# EAGLE design LED-Lampe MCU (EAGLE 6.5.0)
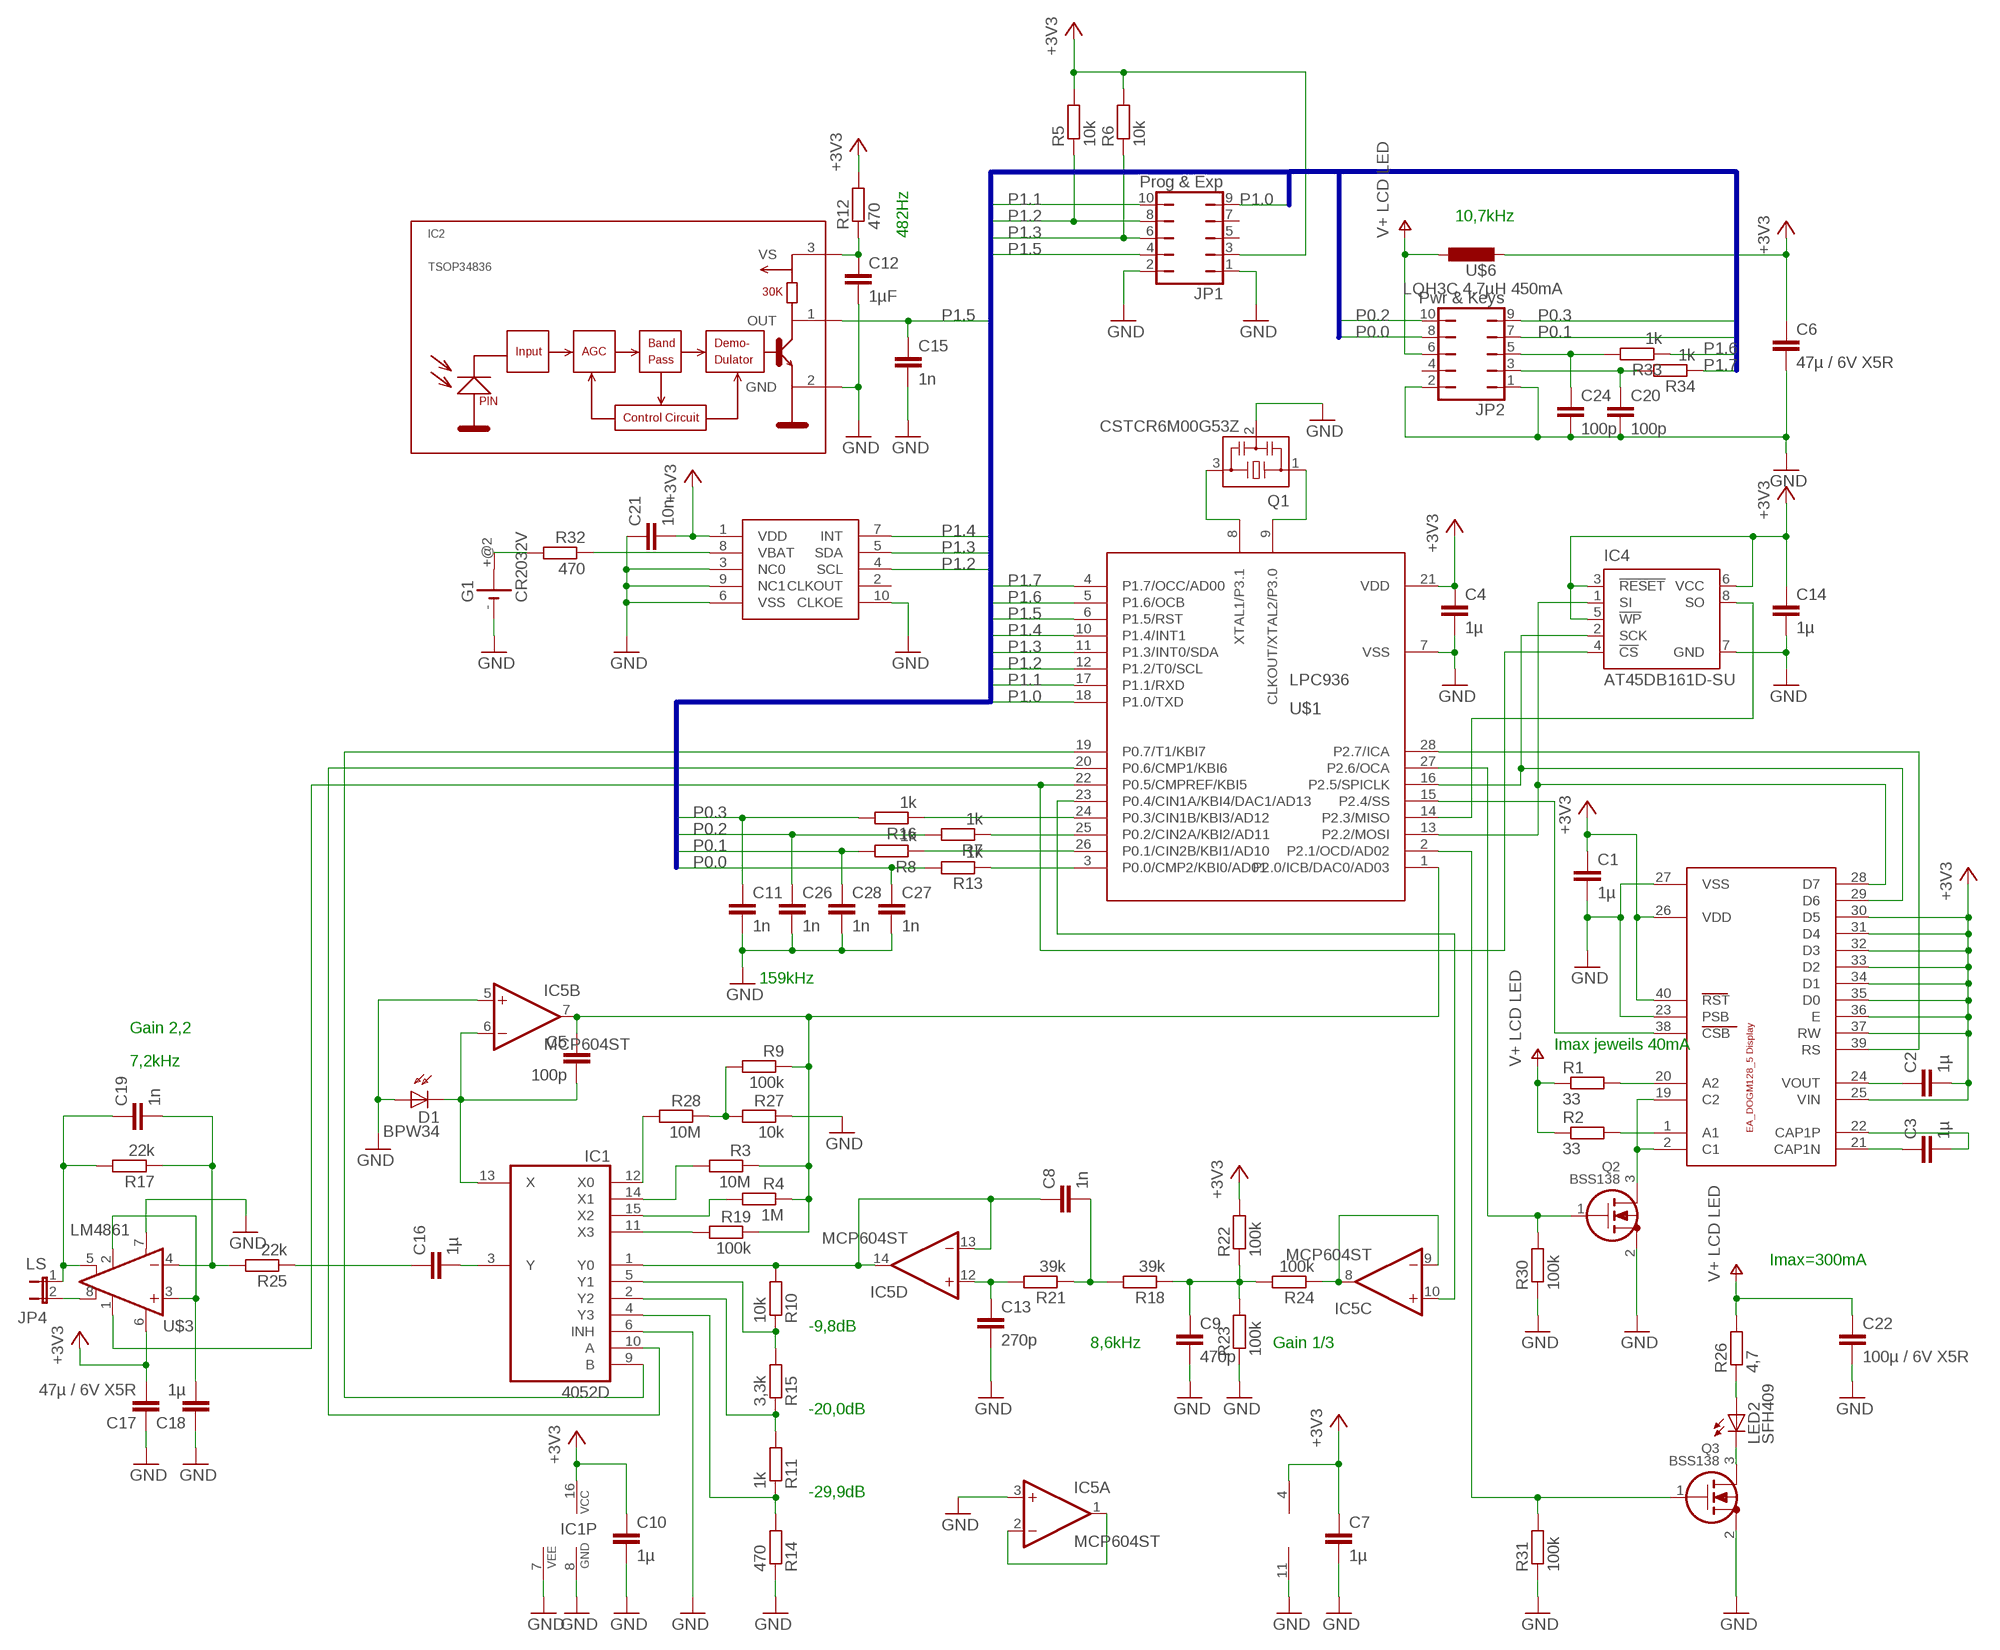
[diagram p0: schematic, sheet 1]

## Parts
C1  1µ  C-EUC0805  [C0805]
C2  1µ  C-EUC0805  [C0805]
C3  1µ  C-EUC0805  [C0805]
C4  1µ  C-EUC0805  [C0805]
C5  100p  C-EUC0603  [C0603]
C6  47µ / 6V X5R  C-EUC1206  [C1206]
C7  1µ  C-EUC0805  [C0805]
C8  1n  C-EUC0805  [C0805]
C9  470p  C-EUC0805  [C0805]
C10  1µ  C-EUC0805  [C0805]
C11  1n  C-EUC0603  [C0603]
C12  1µF  C-EUC0805  [C0805]
C13  270p  C-EUC0805  [C0805]
C14  1µ  C-EUC0805  [C0805]
C15  1n  C-EUC0603  [C0603]
C16  1µ  C-EUC1206  [C1206]
C17  47µ / 6V X5R  C-EUC1206  [C1206]
C18  1µ  C-EUC1206  [C1206]
C19  1n  C-EUC0805  [C0805]
C20  100p  C-EUC0603  [C0603]
C21  10n  C-EUC0805  [C0805]
C22  100µ / 6V X5R  C-EUC1206  [C1206]
C24  100p  C-EUC0603  [C0603]
C26  1n  C-EUC0603  [C0603]
C27  1n  C-EUC0603  [C0603]
C28  1n  C-EUC0603  [C0603]
D1  BPW34  BPW32  [BPW32]
G1  CR2032V  [CR2032V]
IC1  4052D  [SO16]
IC2  TSOP34836  [TSOP348]
IC4  AT45DB161D-SU  [8S2]
IC5  MCP604ST  [TSSOP14]
JP1  Prog & Exp  JP5Q  [JP5Q]
JP2  Pwr & Keys  JP5Q  [JP5Q]
JP4  LS  JP1E  [JP1]
LED2  SFH409  LED3MM  [LED3MM]
Q1  CSTCR6M00G53Z  [CSTCR6M]
Q2  BSS138  [SOT23]
Q3  BSS138  [SOT23]
R1  33  R-EU_R1206  [R1206]
R2  33  R-EU_R1206  [R1206]
R3  10M  R-EU_R0805  [R0805]
R4  1M  R-EU_R0805  [R0805]
R5  10k  R-EU_R0805  [R0805]
R6  10k  R-EU_R0805  [R0805]
R7  1k  R-EU_R0805  [R0805]
R8  1k  R-EU_R0805  [R0805]
R9  100k  R-EU_R0805  [R0805]
R10  10k  R-EU_R0805  [R0805]
R11  1k  R-EU_R0805  [R0805]
R12  470  R-EU_R0805  [R0805]
R13  1k  R-EU_R0805  [R0805]
R14  470  R-EU_R0805  [R0805]
R15  3,3k  R-EU_R0805  [R0805]
R16  1k  R-EU_R0805  [R0805]
R17  22k  R-EU_R0805  [R0805]
R18  39k  R-EU_R0805  [R0805]
R19  100k  R-EU_R0805  [R0805]
R21  39k  R-EU_R0805  [R0805]
R22  100k  R-EU_R0805  [R0805]
R23  100k  R-EU_R0805  [R0805]
R24  100k  R-EU_R0805  [R0805]
R25  22k  R-EU_R0805  [R0805]
R26  4,7  R-EU_R1206  [R1206]
R27  10k  R-EU_R0805  [R0805]
R28  10M  R-EU_R0805  [R0805]
R30  100k  R-EU_R0805  [R0805]
R31  100k  R-EU_R0805  [R0805]
R32  470  R-EU_R0805  [R0805]
R33  1k  R-EU_R0805  [R0805]
R34  1k  R-EU_R0805  [R0805]
U$1  LPC936  [TSSOP28]
U$2  EA_DOGM162  [E_DOG-M162]
U$3  LM4861  [SO08]
U$4  RV3029-C2  [MC_RTC]
U$6  LQH3C 4,7µH 450mA  LQH3C  [L1210]

## Nets
+3V3: C1.1 C2.2 C4.1 C6.1 C7.1 C10.1 C14.1 C17.2 C21.2 IC1.16(VCC) IC4.3(!RESET) IC4.5(!WP) IC4.6(VCC) IC5.4(P:V+) JP1.3 R5.2 R6.2 R12.2 R22.2 U$1.21(VDD) U$2.25(VIN) U$2.26(VDD) U$2.30(D5) U$2.31(D4) U$2.32(D3) U$2.33(D2) U$2.34(D1) U$2.35(D0) U$2.36(E) U$2.37(RW) U$2.40(RST) U$3.6(VDD) U$4.1(VDD) U$6.2
GND: C1.2 C4.2 C6.2 C7.2 C9.2 C10.2 C11.2 C12.2 C13.2 C14.2 C15.2 C17.1 C18.1 C20.2 C21.1 C22.2 C24.2 C26.2 C27.2 C28.2 D1.A G1.- IC1.6(INH) IC1.7(VEE) IC1.8(GND) IC2.2(GND) IC4.7(GND) IC5.3(A:+IN) IC5.5(B:+IN) IC5.11(P:V-) JP1.1 JP1.2 JP2.1 JP2.2 Q1.2 Q2.2(S) Q3.2(S) R14.1 R23.1 R27.1 R30.1 R31.1 U$1.7(VSS) U$2.23(PSB) U$2.27(VSS) U$3.7(GND) U$4.3(NC0) U$4.6(VSS) U$4.9(NC1) U$4.10(CLKOE)
N$1: C2.1 U$2.24(VOUT)
N$2: IC1.9(B) U$1.19(P0.7/T1/KBI7)
N$3: C3.2 U$2.22(CAP1P)
N$4: C3.1 U$2.21(CAP1N)
N$5: U$1.15(P2.4/SS) U$2.38(CSB)
N$6: C12.1 IC2.3(VS) R12.1
N$7: R1.2 U$2.20(A2)
N$8: R2.2 U$2.1(A1)
N$9: IC4.2(SCK) U$1.16(P2.5/SPICLK) U$2.29(D6)
N$10: IC4.1(SI) U$1.13(P2.2/MOSI) U$2.28(D7)
N$11: Q2.1(G) R30.2 U$1.27(P2.6/OCA)
N$12: IC1.10(A) U$1.20(P0.6/CMP1/KBI6)
N$13: U$1.28(P2.7/ICA) U$2.39(RS)
N$14: Q1.3 U$1.8(XTAL1/P3.1)
N$15: Q1.1 U$1.9(CLKOUT/XTAL2/P3.0)
N$16: Q2.3(D) U$2.2(C1) U$2.19(C2)
N$17: R8.1 U$1.26(P0.1/CIN2B/KBI1/AD10)
N$18: JP4.2 U$3.8(VO2)
N$19: R16.1 U$1.24(P0.3/CIN1B/KBI3/AD12)
N$20: R13.1 U$1.3(P0.0/CMP2/KBI0/AD01)
N$21: C18.2 U$3.2(BYPASS) U$3.3(+IN)
N$22: R7.1 U$1.25(P0.2/CIN2A/KBI2/AD11)
N$23: IC4.8(SO) U$1.14(P2.3/MISO)
N$25: IC1.4(Y3) R11.1 R14.2
N$26: IC1.2(Y2) R11.2 R15.1
N$27: IC1.5(Y1) R10.1 R15.2
N$28: C8.1 IC1.1(Y0) IC5.13(D:-IN) IC5.14(D:OUT) R10.2
N$29: C13.1 IC5.12(D:+IN) R21.2
N$30: C8.2 R18.2 R21.1
N$31: LED2.A R26.1
N$32: IC5.10(C:+IN) U$1.23(P0.4/CIN1A/KBI4/DAC1/AD13)
N$33: C5.2 D1.K(C) IC1.13(X) IC5.6(B:-IN)
N$34: C5.1 IC5.7(B:OUT) R3.1 R4.1 R9.1 R19.1 U$1.1(P2.0/ICB/DAC0/AD03)
N$35: IC1.11(X3) R19.2
N$36: C9.1 R18.1 R22.1 R23.2 R24.2
N$37: Q3.1(G) R31.2 U$1.2(P2.1/OCD/AD02)
N$38: IC1.15(X2) R4.2
N$39: IC1.14(X1) R3.2
N$40: IC1.12(X0) R28.2
N$41: C19.2 R17.1 R25.2 U$3.4(-IN)
N$42: C16.1 R25.1
N$44: C16.2 IC1.3(Y)
N$45: C19.1 JP4.1 R17.2 U$3.5(VO1)
N$46: LED2.K(C) Q3.3(D)
N$47: IC4.4(!CS) U$1.22(P0.5/CMPREF/KBI5) U$3.1(SHUTDOWN)
N$49: R32.1 U$4.8(VBAT)
N$50: R9.2 R27.2 R28.1
N$51: IC5.8(C:OUT) IC5.9(C:-IN) R24.1
N$52: G1.+@2(+) R32.2
N$53: IC5.1(A:OUT) IC5.2(A:-IN)
N$55: C24.1 JP2.5 R33.2
N$56: C20.1 JP2.3 R34.2
P0.0: C27.1 JP2.8 R13.2
P0.1: C28.1 JP2.7 R8.2
P0.2: C26.1 JP2.10 R7.2
P0.3: C11.1 JP2.9 R16.2
P1.0: JP1.9 U$1.18(P1.0/TXD)
P1.1: JP1.10 U$1.17(P1.1/RXD)
P1.2: JP1.8 R5.1 U$1.12(P1.2/T0/SCL) U$4.4(SCL)
P1.3: JP1.6 R6.1 U$1.11(P1.3/INT0/SDA) U$4.5(SDA)
P1.4: U$1.10(P1.4/INT1) U$4.7(INT)
P1.5: C15.1 IC2.1(OUT) JP1.4 U$1.6(P1.5/RST)
P1.6: R33.1 U$1.5(P1.6/OCB)
P1.7: R34.1 U$1.4(P1.7/OCC/AD00)
V+: C22.1 JP2.6 R1.1 R2.1 R26.2 U$6.1 ; supply symbol labelled V+ LCD LED
Unconnected: G1.+ JP1.5 JP1.7 JP2.4 U$4.2(CLKOUT)

## Buses
P1.[0..7],P0.[0..7]

## Notes on the sheet
- 10,7kHz
- 482Hz
- 159kHz
- Gain 2,2
- Imax jeweils 40mA
- 7,2kHz
- Imax=300mA
- -9,8dB
- 8,6kHz | Gain 1/3
- -20,0dB
- -29,9dB

## Library data of the parts
C1-C5 C7-C21 C24 C26-C28 = rcl:C-EU: CAPACITOR, European symbol
C6 C22 = resistor:C-EU: CAPACITOR, European symbol
D1 = opto-trans-siemens:BPW32: PHOTO DIODE; OC_FARNELL: unknown; OC_NEWARK: unknown
G1 = battery:CR2032V: LI BATTERY Varta
IC1 = 40xx:4052: Dual 4-channel ANALOG MULTIPLEXER
IC2 = vishay-1:TSOP348*: IR Receiver Modules for Remote Control Systems http://www.vishay.com/ir-receiver-modules/
IC4 = atmel:AT45DB161D: 16-megabit 2.5V or 2.7V DataFlash Source: http://www.atmel.com/dyn/resources/prod_documents/doc3500.pdf; MF: ATMEL; MPN: AT45DB161D-SU; OC_FARNELL: 1455040
IC5 = linear:MCP604: Quad Op Amp 2.7V to 6.0V Single Supply CMOS Source: http://ww1.microchip.com/downloads/en/DeviceDoc/21314g.pdf
JP1 JP2 = jumper:JP5Q: JUMPER
JP4 = jumper:JP1E: JUMPER
LED2 = led:LED: LED OSRAM: - CHIPLED LG R971, LG N971, LY N971, LG Q971, LY Q971, LO R971, LY R971 LH N974, LH R974 LS Q976, LO Q976, LY Q976 LO Q996 - Hyper CHIPLED LW Q18S LB Q993, LB Q99A, LB R99A - SideLED LS A670, LO A670, LY A670, LG A670, LP A670 LB A673, LV A673, LT A673, LW A673 LH A674 LY A675 LS A676, LA A676, LO A676, LY A676, LW A676 LS A679, LY A679, LG A679 - Hyper Micro SIDELED® LS Y876, LA Y876, LO Y876, LY Y876 LT Y87S - SmartLED LW L88C, LW L88S LB L89C, LB L89S, LG L890 LS L89K, LO L89K, LY L89K LS L896, LA L896, LO L896, LY L896 - TOPLED LS T670, LO T670, LY T670, LG T670, LP T670 LSG T670, LSP T670, LSY T670, LOP T670, LYG T670 LG T671, LOG T671, LSG T671 LB T673, LV T673, LT T673, LW T673 LH T674 LS T676, LA T676, LO T676, LY T676, LB T676, LH T676, LSB T676, LW T676 LB T67C, LV T67C, LT T67C, LS T67K, LO T67K, LY T67K, LW E67C LS E67B, LA E67B, LO E67B, LY E67B, LB E67C, LV E67C, LT E67C LW T67C LS T679, LY T679, LG T679 LS T770, LO T770, LY T770, LG T770, LP T770 LB T773, LV T773, LT T773, LW T773 LH T774 LS E675, LA E675, LY E675, LS T675 LS T776, LA T776, LO T776, LY T776, LB T776 LHGB T686 LT T68C, LB T68C - Hyper Mini TOPLED® LB M676 - Mini TOPLED Santana® LG M470 LS M47K, LO M47K, LY M47K Source: http://www.osram.convergy.de LUXEON: - LUMILED® LXK2-PW12-R00, LXK2-PW12-S00, LXK2-PW14-U00, LXK2-PW14-V00 LXK2-PM12-R00, LXK2-PM12-S00, LXK2-PM14-U00 LXK2-PE12-Q00, LXK2-PE12-R00, LXK2-PE12-S00, LXK2-PE14-T00, LXK2-PE14-U00 LXK2-PB12-K00, LXK2-PB12-L00, LXK2-PB12-M00, LXK2-PB14-N00, LXK2-PB14-P00, LXK2-PB14-Q00 LXK2-PR12-L00, LXK2-PR12-M00, LXK2-PR14-Q00, LXK2-PR14-R00 LXK2-PD12-Q00, LXK2-PD12-R00, LXK2-PD12-S00 LXK2-PH12-R00, LXK2-PH12-S00 LXK2-PL12-P00, LXK2-PL12-Q00, LXK2-PL12-R00 Source: www.luxeon.com KINGBRIGHT: KA-3528ASYC Source: www.kingbright.com
Q1 = murata-filter:CSTCR: Resonator Source: murata.co.jp; MPN: CSTCR6M00G53-R0; OC_FARNELL: 1170434; OC_NEWARK: 25M8759
Q2 Q3 = transistors:BSS138: BSS138: N-channel enhancement MOSFET (ON Semiconductor) 50V Uds, 200mA Id, 225mW Ptot, 3.5Ω Rdson
R1 R2 R5-R8 R12 R13 R16 R17 R25 R26 R30 R31 R33 R34 = rcl:R-EU_: RESISTOR, European symbol
R3 R4 R9-R11 R14 R15 R18 R19 R21-R24 R27 R28 R32 = resistor:R-EU_: RESISTOR, European symbol
U$1 = nxp:LPC936
U$2 = display_ea_dog:EA_DOGM162
U$3 = LM4861:LM4861
U$4 = MicroCrystal:RV3029-C2
U$6 = mcl:LQH3C: muRata Chip Coil LQH3C

## Board
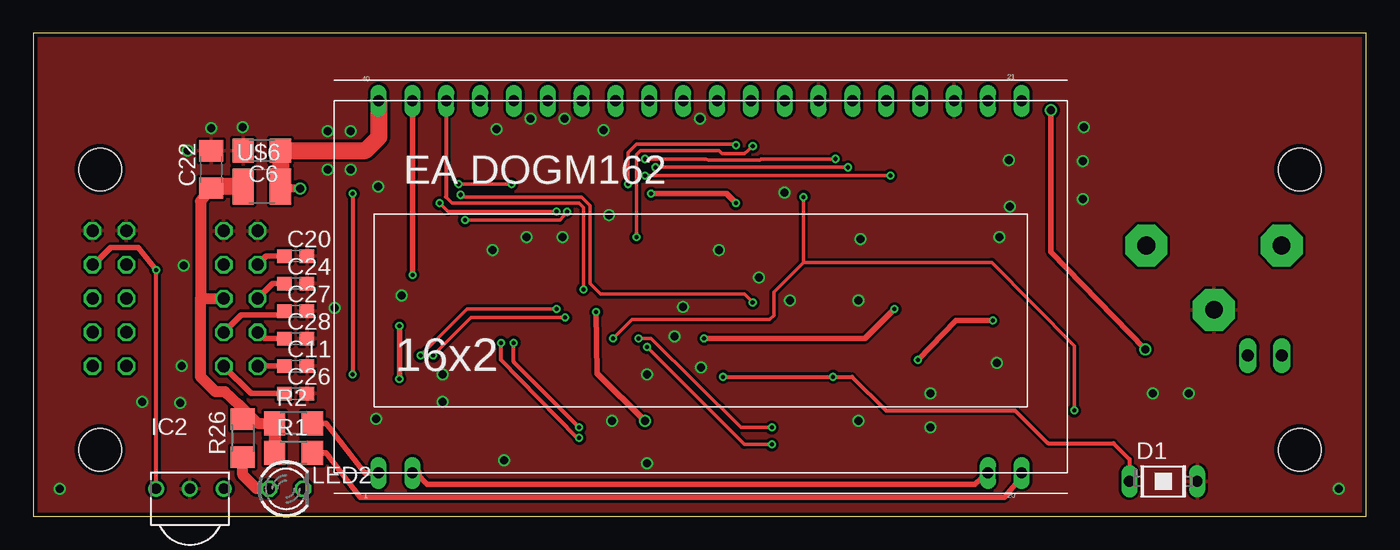
[diagram p1: board, top side]
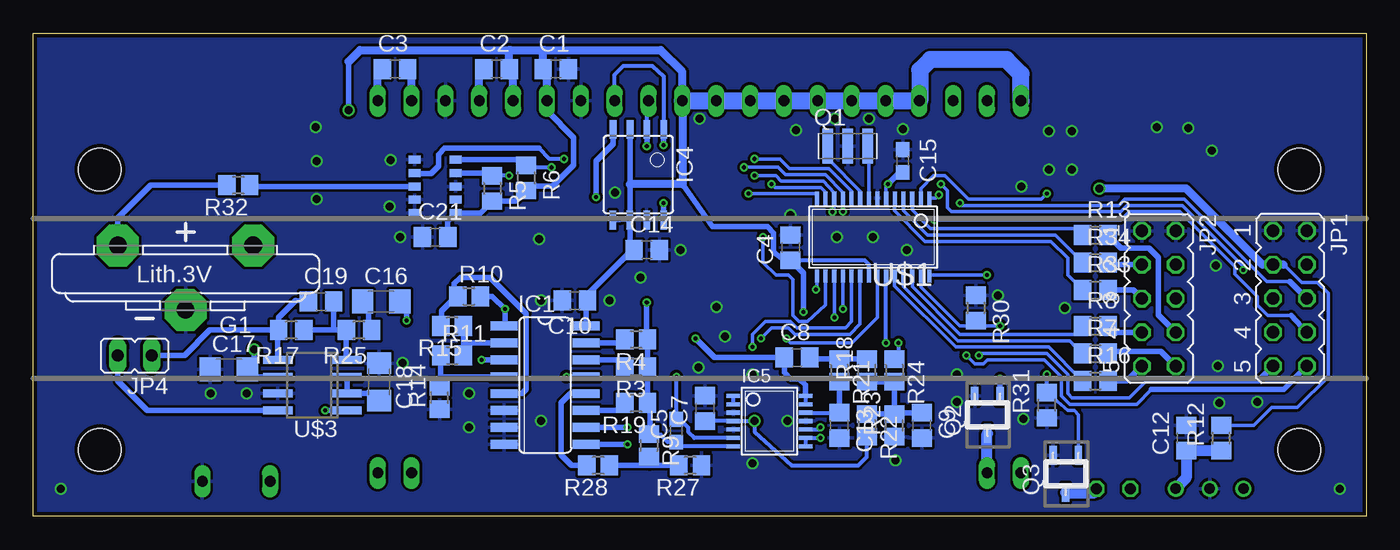
[diagram p2: board, bottom side, seen from below]

Size 100 x 36.25 mm. Coordinates in mm from the lower left corner, seen from the top.
Outline: 0,0 100,0 100,36.26 0,36.26 0,0
Copper layers (1*16): Top 0.035mm / dielectric 1.5mm / Bottom 0.035mm
Design rules "PCB-POOL Standard": minimum track width 0.15mm, minimum drill 0.3mm, track to track 0.15mm, track to pad 0.15mm, pad to pad 0.15mm, via to via 0.15mm, smd to smd 0.15mm, copper to edge 0.3mm, drill to drill 0.2mm, minimum pad ring 0.2mm, minimum via ring 0.15mm, stop-mask expansion 0.075mm, vias tented up to drill 0mil, thermal gap 0.2mm
Holes 3.2 mm at 5,5 5,26.04 95,26.04 95,5

### Footprints (pad centres in the part's own frame; a part is rotated, then mirrored left to right if it is on the bottom)
C0805 = smd 1.3 x 1.5: 1 -0.95,0; 2 0.95,0
C0603 = smd 1.1 x 1: 1 -0.85,0; 2 0.85,0
C1206 = smd 1.6 x 1.8: 1 -1.4,0; 2 1.4,0
BPW32 = drill 0.813 long: A 0,2.54; K 0,-2.54
CR2032V = drill 1.321 pad 3.15 octagon: + -2.54,5.08; +@2 -2.54,-5.08; - 2.286,0
SO16 = smd 0.66 x 2.032: 1 -4.445,-3.073; 2 -3.175,-3.073; 3 -1.905,-3.073; 4 -0.635,-3.073; 5 0.635,-3.073; 6 1.905,-3.073; 7 3.175,-3.073; 8 4.445,-3.073; 9 4.445,3.073; 10 3.175,3.073; 11 1.905,3.073; 12 0.635,3.073; 13 -0.635,3.073; 14 -1.905,3.073; 15 -3.175,3.073; 16 -4.445,3.073
TSOP348 = drill 0.8: 1 -2.54,0; 2 0,0; 3 2.54,0
8S2 = smd 0.5 x 1.4: 1 -1.905,-3.404; 2 -0.645,-3.404; 3 0.625,-3.404; 4 1.895,-3.404; 5 1.905,3.404; 6 0.635,3.404; 7 -0.635,3.404; 8 -1.905,3.404
TSSOP14 = smd 0.305 x 0.991: 1 -1.905,-2.718; 2 -1.27,-2.718; 3 -0.635,-2.718; 4 0,-2.718; 5 0.635,-2.718; 6 1.27,-2.718; 7 1.905,-2.718; 8 1.905,2.718; 9 1.27,2.718; 10 0.635,2.718; 11 0,2.718; 12 -0.635,2.718; 13 -1.27,2.718; 14 -1.905,2.718
JP5Q = drill 0.914 octagon: 1 -5.08,-1.27; 2 -5.08,1.27; 3 -2.54,-1.27; 4 -2.54,1.27; 5 0,-1.27; 6 0,1.27; 7 2.54,-1.27; 8 2.54,1.27; 9 5.08,-1.27; 10 5.08,1.27
JP1 = drill 0.914 long: 1 0,-1.27; 2 0,1.27
LED3MM = drill 0.813 octagon: A -1.27,0; K 1.27,0
CSTCR6M = smd 0.8 x 2.6: 1 -1.5,0; 2 0,0; 3 1.5,0
SOT23 = smd 0.55 x 1.4: 1 0.95,1.4; 2 -0.95,1.4; 3 0,-1.4
R1206 = smd 1.6 x 1.803: 1 -1.422,0; 2 1.422,0
R0805 = smd 1.3 x 1.5: 1 -0.85,0; 2 0.85,0
R0805' = smd 1.3 x 1.5: 1 -0.95,0; 2 0.95,0
TSSOP28 = smd 0.305 x 0.991: 1 -4.225,-2.918; 2 -3.575,-2.918; 3 -2.925,-2.918; 4 -2.275,-2.918; 5 -1.625,-2.918; 6 -0.975,-2.918; 7 -0.325,-2.918; 8 0.325,-2.918; 9 0.975,-2.918; 10 1.625,-2.918; 11 2.275,-2.918; 12 2.925,-2.918; 13 3.575,-2.918; 14 4.225,-2.918; 15 4.225,2.918; 16 3.575,2.918; 17 2.925,2.918; 18 2.275,2.918; 19 1.625,2.918; 20 0.975,2.918; 21 0.325,2.918; 22 -0.325,2.918; 23 -0.975,2.918; 24 -1.625,2.918; 25 -2.275,2.918; 26 -2.925,2.918; 27 -3.575,2.918; 28 -4.225,2.918
E_DOG-M162 = drill 0.8 long: 1 -24.098,-13.97; 2 -21.558,-13.97; 19 21.622,-13.97; 20 24.162,-13.97; 21 24.162,13.97; 22 21.622,13.97; 23 19.082,13.97; 24 16.542,13.97; 25 14.002,13.97; 26 11.462,13.97; 27 8.922,13.97; 28 6.382,13.97; 29 3.842,13.97; 30 1.302,13.97; 31 -1.238,13.97; 32 -3.778,13.97; 33 -6.318,13.97; 34 -8.858,13.97; 35 -11.398,13.97; 36 -13.938,13.97; 37 -16.478,13.97; 38 -19.018,13.97; 39 -21.558,13.97; 40 -24.098,13.97
SO08 = smd 0.6 x 2.2: 1 -1.905,-2.6; 2 -0.635,-2.6; 3 0.635,-2.6; 4 1.905,-2.6; 5 1.905,2.6; 6 0.635,2.6; 7 -0.635,2.6; 8 -1.905,2.6
MC_RTC = smd 0.6 x 0.899: 1 -2,-1.549; 2 -1,-1.549; 3 0,-1.549; 4 1,-1.549; 5 2,-1.549; 6 2,1.549; 7 1,1.549; 8 0,1.549; 9 -1,1.549; 10 -2,1.549
L1210 = smd 1.6 x 2.7: 1 -1.4,0; 2 1.4,0

### Placement (x,y rotation side)
C1  60.8,33.58 0 bottom
C2  65.25,33.58 0 bottom
C3  72.87,33.58 0 bottom
C4  43.18,20.16 90 bottom
C5  51.75,6.43 90 bottom
C6  17.14,27.46 180 top
C7  49.61,8.1 90 bottom
C8  42.7,11.91 0 bottom
C9  33.34,6.83 270 bottom
C10  59.37,16.19 180 bottom
C11  19.68,11.27 0 top
C12  13.49,5.87 90 bottom
C13  39.53,6.83 270 bottom
C14  53.98,20 0 bottom
C15  34.77,26.67 90 bottom
C16  73.9,16.11 0 bottom
C17  85.33,11.03 0 bottom
C18  74.06,10.08 270 bottom
C19  78.42,16.11 0 bottom
C20  19.68,19.53 0 top
C21  69.85,20.95 0 bottom
C22  13.34,26.04 90 top
C24  19.68,17.46 0 top
C26  19.68,9.21 0 top
C27  19.68,15.4 0 top
C28  19.68,13.34 0 top
D1  84.77,2.62 270 top
G1  88.58,17.78 270 bottom
IC1  61.59,9.84 270 bottom
IC2  11.75,2.08 0 top
IC4  54.61,25.64 180 bottom
IC5  44.77,7.14 270 bottom
JP1  5.71,16.36 270 bottom
JP2  15.56,16.35 270 bottom
JP4  92.39,12.06 90 bottom
LED2  18.97,2.06 0 top
Q1  38.89,27.78 0 bottom
Q2  28.42,7.62 0 bottom
Q3  22.54,3.17 0 bottom
R1  19.53,4.76 0 top
R2  19.53,6.99 0 top
R3  54.77,11.19 180 bottom
R4  54.77,13.26 180 bottom
R5  10k  [R0805']  65.56,24.61 270 bottom
R6  10k  [R0805']  63.02,25.4 270 bottom
R7  1k  [R0805']  20.32,12.22 0 bottom
R8  1k  [R0805']  20.32,14.29 0 bottom
R9  53.82,5.32 270 bottom
R10  67.31,16.51 0 bottom
R11  68.58,12.06 0 bottom
R12  470  [R0805']  10.87,5.87 90 bottom
R13  1k  [R0805']  20.32,21.11 0 bottom
R14  69.53,8.89 90 bottom
R15  68.58,14.29 180 bottom
R16  1k  [R0805']  20.32,10.16 0 bottom
R17  22k  [R0805']  80.64,13.97 180 bottom
R18  37.47,10.95 90 bottom
R19  54.77,8.49 180 bottom
R21  39.53,10.95 270 bottom
R22  37.47,6.83 270 bottom
R23  35.4,6.83 90 bottom
R24  35.4,10.95 270 bottom
R25  22k  [R0805']  75.56,13.97 180 bottom
R26  15.72,5.87 90 top
R27  50.72,3.81 180 bottom
R28  57.63,3.81 180 bottom
R30  100k  [R0805']  29.29,15.64 270 bottom
R31  100k  [R0805']  23.97,8.33 90 bottom
R32  84.61,24.84 180 bottom
R33  1k  [R0805']  20.32,16.99 0 bottom
R34  1k  [R0805']  20.32,19.05 0 bottom
U$1  36.99,20.95 180 bottom
U$2  50,17.23 0 top
U$3  79.06,9.84 90 bottom
U$4  69.85,24.77 90 bottom
U$6  17.14,24.77 0 top

### Tracks (layer width: path | path; a pad name or v marks a point on that pad's centre or on a via)
+3V3  (via drill 0.3, 0.6)
  Top 0.406: 18.57,25.21 U$6.2 | v45.88,7.14 42.31,10.72 v42.23,15.33 | v83.42,12.54 76.36,19.84 v76.36,30.48 | 18.49,27.51 C6.1
  Top 0.61: v20,24.61 19.05,24.61 18.57,25.21
  Top 1.27: U$6.2 C6.1 24.92,27.46 25.93,28.47 25.93,31.04 U$2.40
  Bottom 0.152: 51.28,31.91 51.28,32.07 U$2.30 | 55.33,22.31 IC4.6 | 33.5,31.2 U$2.37 | 42.7,18.73 C4.1 | 55.24,20.16 54.92,20.16 C14.1
  Bottom 0.254: R12.2 8.42,6.82 7.06,8.18 5.16,8.18 2.86,10.48 2.86,16.75 3.65,17.54 4.84,17.54 6.19,18.89 | JP1.3
  Bottom 0.305: U$1.21 37.31,18.9 37.62,19.21 C4.1 | 76.36,34.13 | R22.2 37.47,4.45 38.1,3.81 43.1,3.81 45.88,6.35 v45.88,7.14 IC5.4 49.45,7.14 C7.1
  Bottom 0.406: IC4.5 55.33,22.31 IC4.6 | C14.1 55.24,20.16 IC4.6 55.24,24.92 55.24,29.11 IC4.3 | C17.2 83.66,10.48 U$3.6 83.66,10.48 83.42,10.56 v83.42,12.54 | IC1.16 58.52,16.09 C10.1 58.42,16.67 55.24,19.84 55.24,20.16 | R5.2 66.45,22.77 U$4.1 68.9,22.17 C21.2 | C4.1 43.66,19.21 44.45,19.84 44.45,21.27 44.93,21.75 49.05,21.75 51.28,24.92 | v42.23,15.33 42.23,18.26 42.7,18.73 | v76.36,30.48 76.36,34.13 | R5.2 | R5.2 63.82,23.65 R6.2 62.71,24.77 61.04,24.77 59.45,26.35 59.45,28.42 61.44,30.4 61.44,31.17 U$2.26
  Bottom 0.61: U$2.30 51.3,33.36 52.94,35 61.67,35 | 51.28,31.91 51.28,24.92 55.24,24.92 | 76.36,34.13 75.49,35 64.21,35 | 64.21,35 61.67,35 | v20,24.61 13.49,24.61 7.78,18.89 JP1.3 | 64.21,35 64.3,35.01 C2.2 64,33.36 U$2.25 | U$2.26 61.46,33.47 C1.1 61.75,35 61.67,35 | 6.19,18.89 JP1.3
  Bottom 1.27: U$2.30 U$2.31 U$2.32 U$2.33 U$2.34 U$2.35 U$2.36 U$2.37 | U$2.40 25.9,33.2 26.99,34.29 32.7,34.29 33.5,33.5 33.5,31.2 33.5,31.19
GND  (via drill 0.6)
  other vias: 15.72,29.21 78.82,29.21 22.07,28.89 13.34,29.13 54.45,17.94 56.75,16.19 36.99,20.95 43.18,22.62 25.88,24.77 27.62,16.59 22.07,26.04 11.59,27.46 35.32,4.21 11.11,11.27 11.03,8.49 30.72,10.64 25.72,7.3 30.72,8.57 46.04,10.64 50.09,11.19 48.74,15.72 48.1,13.49 61.91,16.19 72.47,20.95 51.44,20 86.68,9.21 83.98,9.21 61.91,7.14 72.31,11.51 23.81,26.04 1.98,2.06 73.18,26.75 73.26,23.26 39.69,20.95 34.45,20 34.77,29.05 42.78,28.97 39.85,29.84 37.31,29.84 56.36,24.29 50.01,29.84 62.07,20.8 46.04,3.97 11.27,18.81 22.62,15.64 67.31,6.67 67.31,9.21 97.95,2.06 78.74,23.81 78.74,26.67 23.81,28.89 43.42,7.14 8.18,8.57
  pour Top (isolate 0.203): 0,36.25 100,36.25 100,0 0,0
  pour Bottom (isolate 0.203): 0,0 100.01,0 100.01,36.25 0,36.25
N$1
  Bottom 0.61: U$2.24 66.54,33.07 C2.1
N$2  (via drill 0.3)
  Top 0.254: v55.4,5.4 53.34,5.4 v46.04,12.7
  Bottom 0.152: 38.6,18 U$1.19
  Bottom 0.254: v46.04,12.7 46.04,13.65 45.09,14.61 43.18,14.61 42.7,14.13 39.05,14.13 38.6,14.61 38.6,18
  Bottom 0.406: IC1.9 v55.4,5.4
N$3
  Bottom 0.61: U$2.22 71.62,33.36 C3.2
N$4
  Bottom 0.61: U$2.21 74.16,33.23 C3.1
N$5  (via drill 0.3)
  Top 0.152: U$2.38 31.01,31.33 30.96,31.27
  Top 0.254: 30.96,23.97 31.43,23.5 40.96,23.5 41.27,23.18 v41.27,17.04
  Top 0.305: 30.96,31.27 30.96,23.97
  Bottom 0.254: U$1.15 41.21,17.05 v41.27,17.04
N$6
  Bottom 0.813: R12.1 C12.1 13.49,2.87 IC2.3
N$7
  Top 0.406: R1.2 21.99,4.76 24.53,1.43 72.87,1.43 74.14,2.94 74.14,3.23
  Top 0.813: 74.14,3.23 U$2.20
N$8
  Top 0.406: U$2.1 24.84,3.26 21.99,6.99 R2.2
N$9  (via drill 0.3 pad 0.3)
  Top 0.254: v53.98,27.78 53.34,27.23 51.67,27.23 51.44,27.46 45.56,27.46 45.24,27.15 v45.24,20.95
  Bottom 0.152: 53.97,27.79 v53.98,27.78 | 40.56,17.93 U$1.16
  Bottom 0.254: v45.24,20.95 45.24,19.05 44.29,18.1 43.34,18.1 43.02,17.78 43.02,15.08 42.55,14.61 41.91,14.61 40.56,15.85 40.56,17.93
  Bottom 0.305: IC4.2 53.97,31.1 U$2.29
  Bottom 0.406: IC4.2 53.97,27.79
N$10  (via drill 0.3 pad 0.3)
  Top 0.254: v44.61,24.92 44.61,27.3 45.24,27.94 52.63,27.94 v52.7,27.86
  Bottom 0.254: 52.7,29.21 IC4.1 | U$1.13 40.56,24.32 40.9,24.69 44.37,24.69 v44.61,24.92
  Bottom 0.305: U$2.28 56.38,33.15 55.72,33.81 53.58,33.81 52.7,33.02 52.7,29.21
  Bottom 0.406: v52.7,27.86 52.7,29.21
N$11  (via drill 0.3)
  Top 0.406: v27.46,10.32 v27.46,14.29
  Bottom 0.152: U$1.27 33.44,18.04
  Bottom 0.254: v27.46,14.29 29.37,14.29 30.48,14.29 33.41,17.22 33.41,18.02 33.44,18.04
  Bottom 0.305: R30.2 29.37,14.69 29.37,14.29
  Bottom 0.406: Q2.1 27.47,9.52 v27.46,10.32
N$12  (via drill 0.3)
  Top 0.254: v45.4,13.34 46.35,13.34 53.1,6.67 v55.4,6.67
  Bottom 0.152: U$1.20 37.96,18.07 37.97,18.1
  Bottom 0.254: v45.4,13.34 44.61,14.13 43.34,14.13 42.86,13.65 38.73,13.65 37.97,14.45 37.97,18.1
  Bottom 0.406: IC1.10 v55.4,6.67
N$13  (via drill 0.3)
  Top 0.406: v28.44,18.12 U$2.39
  Bottom 0.152: 32.68,18.12 U$1.28 | v28.44,18.12 28.42,18.1
  Bottom 0.254: 32.68,18.12 v28.44,18.12
N$14
  Bottom 0.152: 37.31,27.63 37.47,27.78 Q1.3
  Bottom 0.254: U$1.8 37.31,27.63
N$15
  Bottom 0.152: 40.32,26.78 40.32,27.71 Q1.1
  Bottom 0.254: U$1.9 37.96,24.42 40.32,26.78
N$16
  Top 0.406: 71.52,3.18 70.64,2.38 29.53,2.38 28.73,3.26
  Top 0.813: U$2.19 71.52,3.18 | U$2.2 28.73,3.26
  Bottom 0.813: U$2.2 28.44,6.2 Q2.3
N$17
  Bottom 0.152: R8.1 21.27,13.81 21.43,13.65 | 34.05,17.92 U$1.26
  Bottom 0.254: 21.43,13.65 30.48,13.65 34.05,17.25 34.05,17.92
N$18
  Bottom 0.406: JP4.2 93.66,10.16 91.44,7.94 U$3.8 81.6,7.94
N$19
  Bottom 0.152: R16.1 21.43,10.32 | U$1.24 35.36,18.06 35.38,18
  Bottom 0.254: 21.43,10.32 23.81,12.7 30.8,12.7 35.38,17.28 35.38,18
N$20
  Bottom 0.152: U$1.3 34.05,23.84
  Bottom 0.254: 34.05,23.84 34.05,22.99 32.7,21.59 21.75,21.59 R13.1
N$21
  Bottom 0.406: U$3.3 U$3.2 73.98,9.21 C18.2
N$22
  Bottom 0.152: R7.1 21.35,12.22 | 34.72,17.96 U$1.25
  Bottom 0.254: 21.35,12.22 22.23,13.18 30.64,13.18 34.72,17.25 34.72,17.96
N$23  (via drill 0.3, 0.3 pad 0.3)
  Top 0.406: v46.35,24.21 51.99,24.21 v52.7,23.5
  Bottom 0.152: U$1.14 41.21,24.07
  Bottom 0.254: 41.21,24.07 41.35,24.21 v46.35,24.21
  Bottom 0.406: v52.7,23.5 IC4.8
N$25
  Bottom 0.406: R11.1 69.43,10.32 | 69.43,10.32 69.43,9.84 R14.2 | IC1.4 69.27,10.48 69.43,10.32
N$26
  Bottom 0.406: IC1.2 67.63,13.02 67.63,12.17 R11.2 R15.1
N$27
  Bottom 0.406: IC1.5 63.34,9.21 63.02,9.53 63.02,15.24 65.72,17.94 67.94,17.94 68.42,17.46 68.42,16.57 R10.1 68.26,16.51 69.37,15.4 69.37,14.45 69.53,14.29 R15.2 69.37,14.29
N$28  (via drill 0.3)
  Top 0.406: v50.32,13.34 62.39,13.34 v64.61,15.56
  Bottom 0.305: IC5.13 IC5.14
  Bottom 0.406: R10.2 65.56,16.51 v64.61,15.56 | v64.61,15.56 64.61,14.35 IC1.1 | v50.32,13.34 48.9,11.91 C8.1 43.65,10.79 43.18,10.32 42.55,10.32 42.07,9.84 42.07,9.07 IC5.14 | v64.61,15.56 64.61,14.29
N$29
  Bottom 0.305: IC5.12 39.69,7.78 C13.1
  Bottom 0.406: 39.85,7.94 C13.1 R21.2
N$30
  Bottom 0.152: 42.07,11.91 41.91,11.91 41.75,11.8
  Bottom 0.254: 41.75,11.8 41.97,11.96
  Bottom 0.406: R18.2 R21.1 41.75,11.8 | C8.2 42.07,11.91
N$31
  Top 0.813: LED2.A 16.74,2.06 16.27,2.54 15.72,3.1 R26.1
N$32  (via drill 0.3)
  Top 0.305: v40.96,6.67 36.04,11.59 v36.04,13.02
  Bottom 0.305: IC5.10 41.12,6.51 v40.96,6.67 | v36.04,13.02 36.04,18.1 U$1.23
N$33  (via drill 0.3)
  Top 0.305: v51.75,10.48 v60.01,10.48 61.44,10.48 63.98,7.94 73.66,7.94 76.12,5.48 81.04,5.48 82.23,4.29 D1.K
  Bottom 0.305: v51.75,10.48 C5.2 51.49,7.28 50.88,6.67 50.88,6.35 50.4,5.87 IC5.6
  Bottom 0.406: v60.01,10.48 IC1.13
N$34  (via drill 0.3 pad 0.3)
  Top 0.254: v32.07,24.13 32.23,23.97 41.12,23.97 41.75,23.34 41.75,17.46 42.55,16.67 53.34,16.67 v53.98,16.03
  Bottom 0.152: 53.98,13.71 R4.1
  Bottom 0.254: U$1.1 32.27,23.87 v32.07,24.13
  Bottom 0.305: IC5.7 51.41,5.24 C5.1 52.41,5.58 52.94,6.11 53.76,6.11 R9.1
  Bottom 0.406: R4.1 R3.1 R19.1 53.74,8.49 53.74,6.19 R9.1 | v53.98,16.03 53.98,13.71
N$35
  Bottom 0.406: R19.2 56.12,7.94 IC1.11
N$36
  Bottom 0.406: 35.72,10.16 R24.2 | R18.1 R24.2 | R24.2 R23.2 | R23.2 R22.1 | C9.1 35.32,7.78 35.4,7.78 R23.2
N$37  (via drill 0.3)
  Top 0.305: v23.97,24.21 v23.97,10.64
  Bottom 0.254: U$1.2 33.41,24.61 32.46,25.56 31.59,25.56 29.84,23.81 24.37,23.81 v23.97,24.21 | R31.2 22.38,7.94 21.91,7.94 21.59,7.62 21.59,4.6
  Bottom 0.305: 21.59,4.6 Q3.1 | R31.2 v23.97,10.64
  Bottom 0.406: Q3.1 | R31.2
N$38
  Bottom 0.406: IC1.15 55.8,13.02 R4.2
N$39
  Bottom 0.406: R3.2 55.88,11.59 55.88,11.75 IC1.14
N$40
  Bottom 0.406: R28.2 59.61,3.81 60.4,4.6 60.4,8.49 59.69,9.21 IC1.12
N$41
  Bottom 0.406: R17.1 R25.2 | C19.2 77.47,13.97 R25.2 | R25.2 76.52,11.8 U$3.4
N$42
  Bottom 0.406: R25.1 74.85,13.97 74.85,16.11 C16.1
N$44  (via drill 0.3)
  Top 0.406: v66.36,11.75 69.22,14.68 v71.99,14.68
  Bottom 0.406: IC1.3 v66.36,11.75 | v71.99,14.68 71.99,16.11 C16.2
N$45
  Bottom 0.406: U$3.5 81.66,13.91 R17.2 | R17.2 81.59,14.93 80.33,16.19 C19.1 | JP4.1 88.66,12.06 86.76,13.97 R17.2
N$46
  Bottom 0.813: Q3.3 20.37,1.77 LED2.K
N$47  (via drill 0.3)
  Top 0.254: v43.5,13.34 44.93,14.76 55.24,14.76 55.56,15.08 55.56,16.83 57.78,19.05 | 57.78,19.05 v57.78,23.97 | 57.78,19.05 71.91,19.05 78.11,12.78 v78.11,7.94
  Bottom 0.152: U$1.22 | IC4.4 56.51,29.06 IC4.4
  Bottom 0.254: U$1.22 36.66,14.93 38.58,13.02 43.18,13.02 v43.5,13.34
  Bottom 0.406: v57.78,23.97 57.78,26.67 56.52,27.94 IC4.4 | v78.11,7.94 U$3.1
N$49
  Bottom 0.406: U$4.8 83.68,24.77 R32.1
N$50
  Bottom 0.406: R27.2 53.74,3.81 | 53.74,3.81 R28.1 | R9.2 53.74,4.45 53.74,3.81
N$51  (via drill 0.3)
  Top 0.305: v40.96,5.87 40.8,5.87 35.08,11.75 v35.08,13.02
  Bottom 0.305: IC5.8 IC5.9 v40.96,5.87 | v35.08,13.02 35.08,11.8 R24.1
N$52
  Bottom 0.406: R32.2 91.2,24.84 93.66,22.38 G1.+@2
N$53
  Bottom 0.305: IC5.2 IC5.1
N$55
  Top 0.406: C24.1 17.94,17.46 JP2.5
  Bottom 0.406: JP2.5 17.46,16.98 R33.2
N$56
  Top 0.406: C20.1 17.47,19.53 JP2.3
  Bottom 0.406: JP2.3 18.9,18.89 R34.2
P0.0
  Top 0.406: 18.89,15.4 C27.1 18.78,15.4 18.49,15.11 15.59,15.11 JP2.8
  Bottom 0.406: JP2.8 15.6,15.12 15.6,19.43 16.31,20.14 18.4,20.14 R13.2
P0.1
  Top 0.152: JP2.7
  Top 0.406: C28.1 17.3,13.34 JP2.7
  Bottom 0.152: R8.2 | JP2.7 16.84,13.79
  Bottom 0.406: R8.2 18.89,13.81 JP2.7
P0.2
  Top 0.406: C26.1 16.35,9.21 JP2.10
  Bottom 0.152: 18.73,12.38 R7.2
  Bottom 0.406: JP2.10 15.4,12.38 18.73,12.38
P0.3
  Top 0.152: JP2.9
  Top 0.406: C11.1 JP2.9
  Bottom 0.406: JP2.9 17.94,10.16 R16.2
P1.0  (via drill 0.3, 0.3 pad 0.3)
  Top 0.254: v39.26,15.56 32.54,15.56 v29.05,12.06
  Bottom 0.152: 39.26,17.98 U$1.18 | v29.05,12.06 28.89,12.22
  Bottom 0.254: v39.26,15.56 39.26,17.98 | 28.89,12.22 23.97,12.22 22.38,10.64 22.38,9.21 22.07,8.89 17.78,8.89 16.51,10.16
  Bottom 0.406: 16.51,10.16 8.1,10.16 JP1.9
P1.1  (via drill 0.3, 0.3 pad 0.3)
  Top 0.254: v30,12.06 32.86,14.92 v39.9,14.92
  Bottom 0.152: 39.9,17.95 U$1.17 | JP1.10
  Bottom 0.254: v39.9,14.92 39.9,17.95 | 16.11,9.53 17.22,8.41 22.23,8.41 22.86,9.05 22.86,10.48 24.13,11.75 28.42,11.75 28.73,11.43 29.37,11.43 v30,12.06
  Bottom 0.406: JP1.10 6.19,9.53 16.11,9.53
P1.2  (via drill 0.3)
  Top 0.254: v64.29,25.56 v45.88,25.56 | v40.03,22.85 39.53,22.23 v32.38,22.23
  Bottom 0.152: 39.92,23.91 U$1.12 | 66.09,25.77 65.77,25.77 R5.1
  Bottom 0.254: v45.88,25.56 44.29,25.56 43.89,25.16 40.72,25.16 39.92,24.32 39.92,23.91 39.92,22.96 v40.03,22.85 | v32.38,22.23 18.41,22.23 17.78,22.86 13.97,22.86 9.84,18.73 9.84,18.18 8.18,16.51 8.18,15.88 7.38,15.08 5.64,15.08
  Bottom 0.305: v64.29,25.56 R5.1
  Bottom 0.406: U$4.4 66.09,25.77 | JP1.8 5.64,15.08
P1.3  (via drill 0.3)
  Top 0.254: v61.12,26.19 v46.67,26.19 | v39.26,22.89 32.07,22.86 31.11,22.86 v30.48,23.5
  Bottom 0.152: 63.5,26.51 | 39.26,23.93 U$1.11 | 63.5,26.51 R6.1 63.5,26.67 63.6,26.77 | 63.5,26.51 63.18,26.19
  Bottom 0.254: v46.67,26.19 44.13,26.19 43.58,25.64 40.56,25.64 39.26,24.32 39.26,23.93 v39.26,22.89 | v30.48,23.5 30.32,23.34 18.57,23.34 18.1,23.81 13.65,23.81 7.46,17.62 5.71,17.62
  Bottom 0.305: 63.18,26.19 v61.12,26.19
  Bottom 0.406: U$4.5 63.6,26.77 | JP1.6 5.71,17.62
P1.4  (via drill 0.3)
  Top 0.254: v45.88,26.83 50.48,26.83 50.64,26.75 54.53,26.75 54.61,26.83 v60.17,26.83
  Bottom 0.152: U$4.7 71.44,25.72
  Bottom 0.254: U$1.10 38.61,24.41 40.32,26.11 43.26,26.11 43.97,26.83 v45.88,26.83
  Bottom 0.305: v60.17,26.83 61.28,26.83 62.07,27.62
  Bottom 0.406: 62.07,27.62 69.14,27.62 69.61,27.15 69.61,26.27 70.17,25.72 71.44,25.72
P1.5  (via drill 0.3, 0.3 pad 0.3)
  Top 0.254: v31.91,24.92 v35.88,24.92
  Top 0.305: IC2.1 v9.21,18.49
  Top 0.406: JP1.4 4.52,18.89 5.79,20.16 7.86,20.16 v9.21,18.49
  Bottom 0.152: v35.88,24.92 36.01,24.88 | C15.1 34.92,25.88
  Bottom 0.254: v31.91,24.92 31.43,24.45 31.43,23.18 31.11,22.86 18.41,22.86 17.94,23.34 13.81,23.34 9.21,18.73 v9.21,18.49 | U$1.6 36.01,24.77 35.87,24.92 v35.87,24.92 v35.88,24.92
  Bottom 0.406: 34.92,25.88 v35.88,24.92
P1.6
  Bottom 0.152: U$1.5 35.36,23.85 35.38,23.81
  Bottom 0.254: 35.38,23.81 35.38,22.94 33.1,20.64 23.65,20.64 22.38,19.37 22.38,18.1 R33.1
P1.7
  Bottom 0.152: 34.72,23.85 U$1.4
  Bottom 0.254: 34.72,23.85 34.72,22.94 32.91,21.11 23.33,21.11 R34.1
V+
  Top 0.406: 13.46,24.77 C22.1
  Top 0.813: 12.54,16.35 JP2.6 | 12.54,16.35 12.54,10.48 13.65,9.37 14.37,9.37 15.44,8.37 | C22.1 12.54,23.65 12.54,16.35 | R1.1 18.1,6.75 | 18.1,6.75 R2.1 18.18,5.31 | 15.44,8.37 16.83,6.99 17.87,6.99 18.1,6.75 | R26.2 15.72,8.02 15.44,8.37
  Top 1.27: U$6.1 13.46,24.77